# EAGLE schematic BeagleBone Blue (EAGLE 7.3.0)
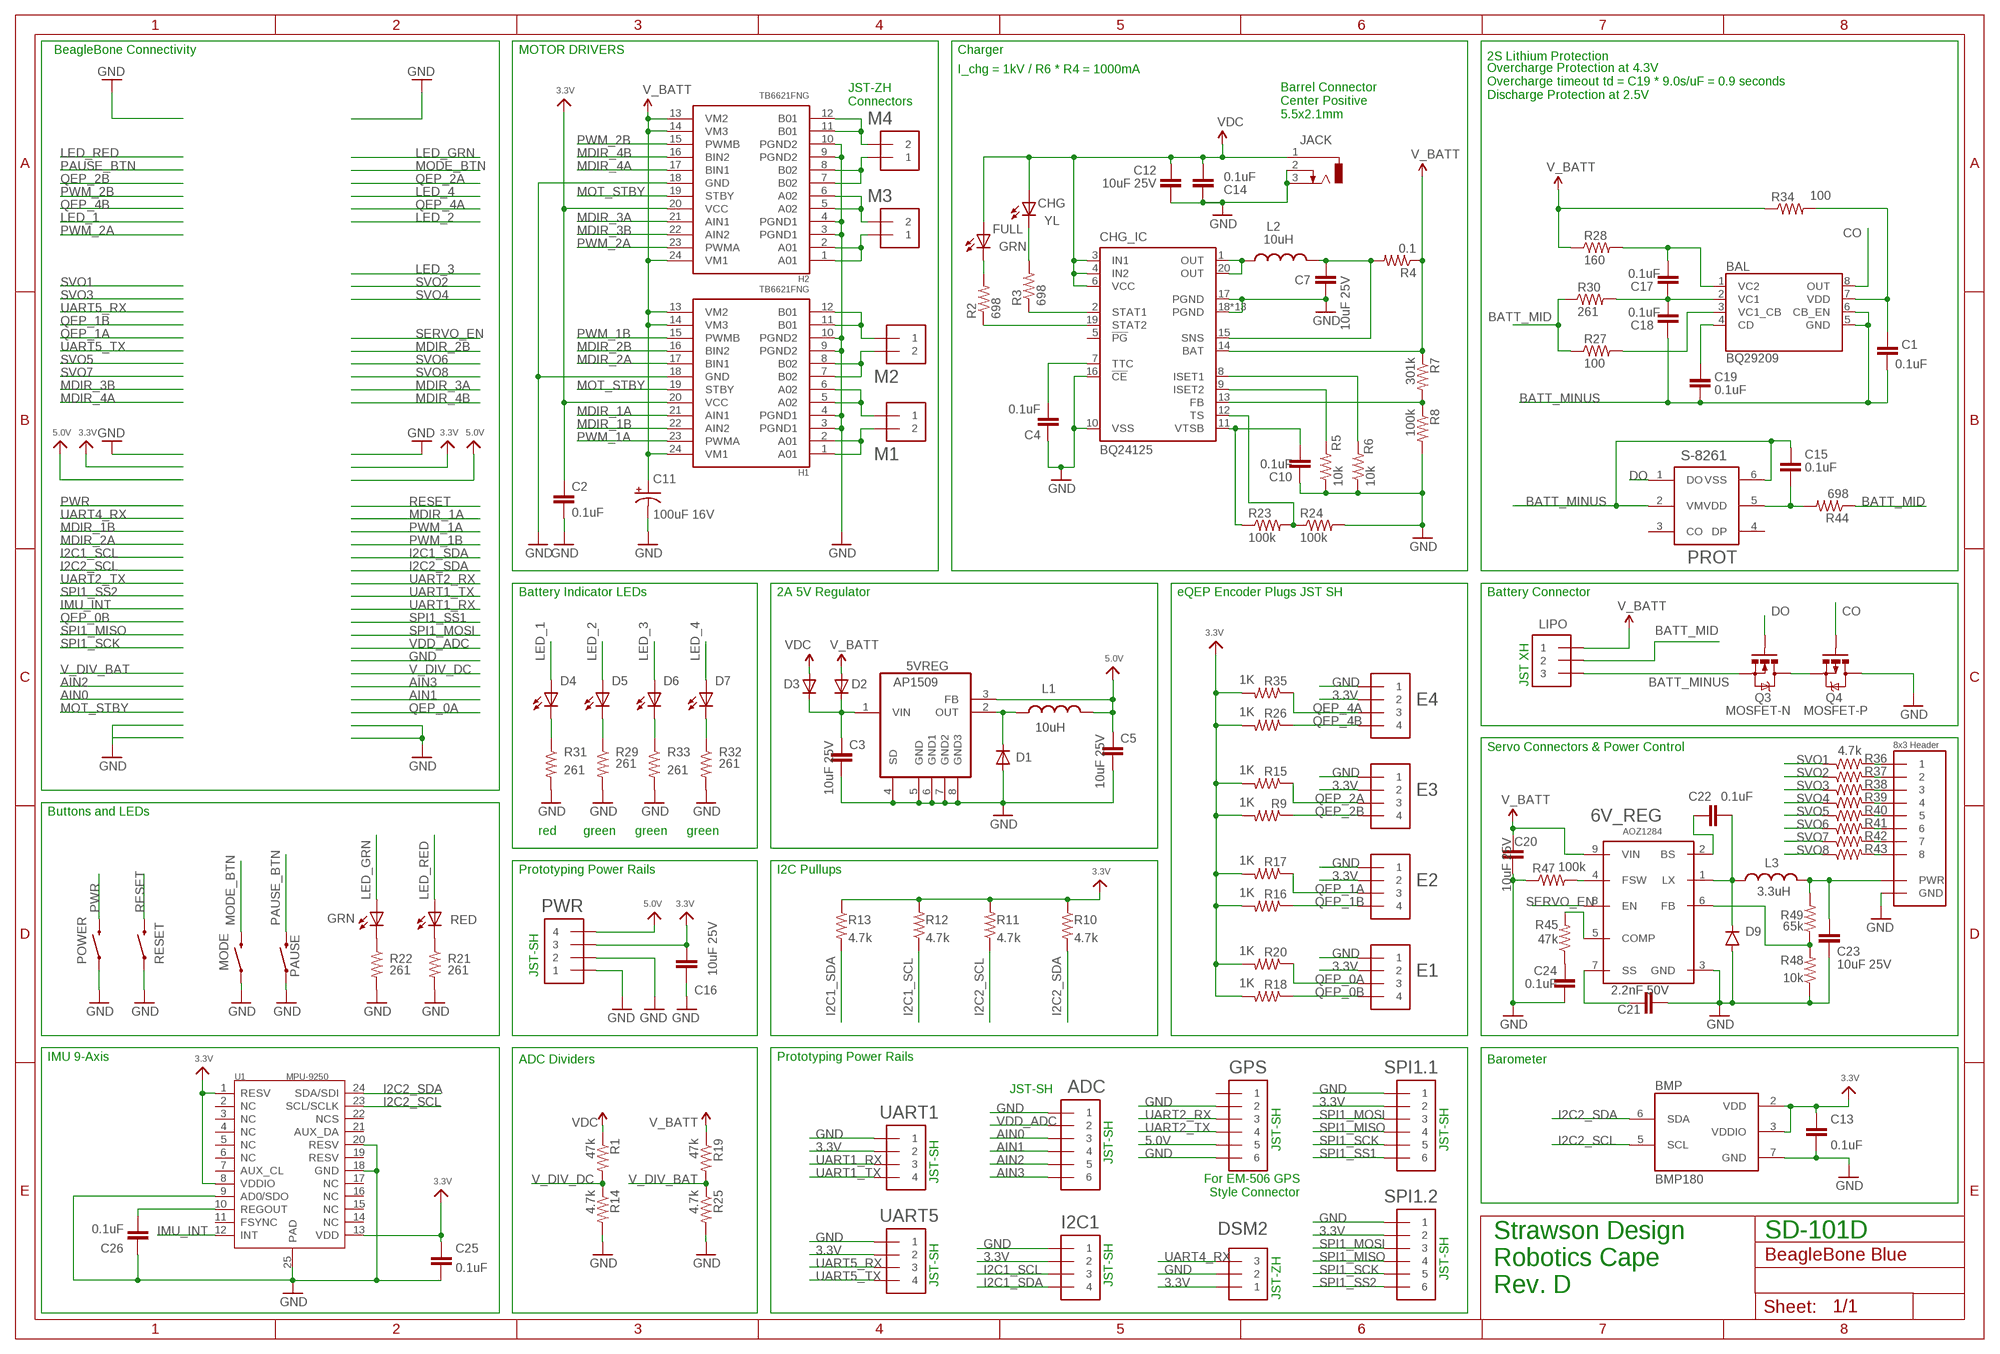
[diagram p0: schematic, sheet 1]

## Parts
5VREG  AP1509SOIC-8-TIGHT  [SO08-TIGHT]
6V_REG  AOZ1284  [SO08-EXPOSED]
ADC  JST_SH_6  [JST_SH_6]
BAL  BQ29209  [8-SON_3X3MM]
BMP  BMP180  [BMP180]
C1  0.1uF  CAP0402-CAP  [0402-CAP]
C2  0.1uF  CAP0402-CAP  [0402-CAP]
C3  10uF 25V  CAP0805  [0805]
C4  0.1uF  CAP0402-CAP  [0402-CAP]
C5  10uF 25V  CAP0805  [0805]
C7  10uF 25V  CAP0805  [0805]
C10  0.1uF  CAP0402-CAP  [0402-CAP]
C11  100uF 16V  CPOL-USD  [PANASONIC_D]
C12  10uF 25V  CAP0805  [0805]
C13  0.1uF  CAP0402-CAP  [0402-CAP]
C14  0.1uF  CAP0402-CAP  [0402-CAP]
C15  0.1uF  CAP0402-CAP  [0402-CAP]
C16  10uF 25V  CAP0805  [0805]
C17  0.1uF  CAP0402-CAP  [0402-CAP]
C18  0.1uF  CAP0402-CAP  [0402-CAP]
C19  0.1uF  CAP0402-CAP  [0402-CAP]
C20  10uF 25V  CAP0805  [0805]
C21  2.2nF 50V  CAP0402-CAP  [0402-CAP]
C22  0.1uF  CAP0402-CAP  [0402-CAP]
C23  10uF 25V  CAP0805  [0805]
C24  0.1uF  CAP0402-CAP  [0402-CAP]
C25  0.1uF  CAP0402-CAP  [0402-CAP]
C26  0.1uF  CAP0402-CAP  [0402-CAP]
CHG  YL  LED0603  [LED-0603]
CHG_IC  BQ24125  [QFN20_3,5X4,5]
D1  DIODESOD-123  [SOD-123]
D2  DIODESOD-123  [SOD-123]
D3  DIODESOD-123  [SOD-123]
D4  RED  LED0603  [LED-0603]
D5  GREEN  LED0603  [LED-0603]
D6  GREEN  LED0603  [LED-0603]
D7  GREEN  LED0603  [LED-0603]
D9  DIODEDO214AA  [DO-214AA]
DSM2  JST_ZH_3  [JST_ZH_3]
E1  JST_SH_4  [JST_SH_4_SMD]
E2  JST_SH_4  [JST_SH_4_SMD]
E3  JST_SH_4  [JST_SH_4_SMD]
E4  JST_SH_4  [JST_SH_4_SMD]
FULL  GRN  LED0603  [LED-0603]
GPS  JST_SH_6  [JST_SH_6]
GRN  GRN  LED0603  [LED-0603]
H1  TB6621FNG  [SSOP24]
H2  TB6621FNG  [SSOP24]
I2C1  JST_SH_4  [JST_SH_4_SMD]
JACK  5.5x2.1mm  DCJ0303  [DCJ0303]
L1  10uH  INDUCTORBOURNS_SRN6045  [SRN6045]
L2  10uH  INDUCTORBOURNS_SRN6045  [SRN6045]
L3  3.3uH  INDUCTOR  [8X8MM_INDUCTOR]
LIPO  JST_XH_3-PIN  [JST_XH_3-PIN]
M1  JST_ZH_2  [JST_ZH_2]
M2  JST_ZH_2  [JST_ZH_2]
M3  JST_ZH_2  [JST_ZH_2]
M4  JST_ZH_2  [JST_ZH_2]
MODE  SWITCH-MOMENTARY-2-SMD-1101NE  [TACTILE-SWITCH-1101NE]
PAUSE  SWITCH-MOMENTARY-2-SMD-1101NE  [TACTILE-SWITCH-1101NE]
POWER  SWITCH-MOMENTARY-2-SMD-1101NE  [TACTILE-SWITCH-1101NE]
PROT  S-8261  [SOT-236]
PWR  JST_SH_4  [JST_SH_4_SMD]
Q3  MOSFET-N  MOSFET-NCHANNEL  [SO08-TIGHT]
Q4  MOSFET-P  MOSFET-PCHANNEL  [SO08-TIGHT]
R1  47k  RESISTOR0402-RES  [0402-RES]
R2  698  RESISTOR0402-RES  [0402-RES]
R3  698  RESISTOR0402-RES  [0402-RES]
R4  0.1  RESISTOR0603  [0603-RES]
R5  10k  RESISTOR0402-RES  [0402-RES]
R6  10k  RESISTOR0402-RES  [0402-RES]
R7  301k  RESISTOR0402-RES  [0402-RES]
R8  100k  RESISTOR0402-RES  [0402-RES]
R9  1K  RESISTOR0402-RES  [0402-RES]
R10  4.7k  RESISTOR0402-RES  [0402-RES]
R11  4.7k  RESISTOR0402-RES  [0402-RES]
R12  4.7k  RESISTOR0402-RES  [0402-RES]
R13  4.7k  RESISTOR0402-RES  [0402-RES]
R14  4.7k  RESISTOR0402-RES  [0402-RES]
R15  1K  RESISTOR0402-RES  [0402-RES]
R16  1K  RESISTOR0402-RES  [0402-RES]
R17  1K  RESISTOR0402-RES  [0402-RES]
R18  1K  RESISTOR0402-RES  [0402-RES]
R19  47k  RESISTOR0402-RES  [0402-RES]
R20  1K  RESISTOR0402-RES  [0402-RES]
R21  261  RESISTOR0402-RES  [0402-RES]
R22  261  RESISTOR0402-RES  [0402-RES]
R23  100k  RESISTOR0402-RES  [0402-RES]
R24  100k  RESISTOR0402-RES  [0402-RES]
R25  4.7k  RESISTOR0402-RES  [0402-RES]
R26  1K  RESISTOR0402-RES  [0402-RES]
R27  100  RESISTOR0402-RES  [0402-RES]
R28  160  RESISTOR0402-RES  [0402-RES]
R29  261  RESISTOR0402-RES  [0402-RES]
R30  261  RESISTOR0402-RES  [0402-RES]
R31  261  RESISTOR0402-RES  [0402-RES]
R32  261  RESISTOR0402-RES  [0402-RES]
R33  261  RESISTOR0402-RES  [0402-RES]
R34  100  RESISTOR0402-RES  [0402-RES]
R35  1K  RESISTOR0402-RES  [0402-RES]
R36  4.7k  RESISTOR0402-RES  [0402-RES]
R37  4.7k  RESISTOR0402-RES  [0402-RES]
R38  4.7k  RESISTOR0402-RES  [0402-RES]
R39  4.7k  RESISTOR0402-RES  [0402-RES]
R40  4.7k  RESISTOR0402-RES  [0402-RES]
R41  4.7k  RESISTOR0402-RES  [0402-RES]
R42  4.7k  RESISTOR0402-RES  [0402-RES]
R43  4.7k  RESISTOR0402-RES  [0402-RES]
R44  698  RESISTOR0402-RES  [0402-RES]
R45  47k  RESISTOR0402-RES  [0402-RES]
R47  100k  RESISTOR0402-RES  [0402-RES]
R48  10k  RESISTOR0402-RES  [0402-RES]
R49  65k  RESISTOR0402-RES  [0402-RES]
RED  RED  LED0603  [LED-0603]
RESET  SWITCH-MOMENTARY-2-SMD-1101NE  [TACTILE-SWITCH-1101NE]
SPI1.1  JST_SH_6  [JST_SH_6]
SPI1.2  JST_SH_6  [JST_SH_6]
U1  MPU-9250  [QFN24G-0.4-3X3MM]
U$1  SERVO_HEADERS_8X  [3X8_0.1"_HEADER]
UART1  JST_SH_4  [JST_SH_4_SMD]
UART5  JST_SH_4  [JST_SH_4_SMD]

## Nets
3.3V: BMP.2(VDD) BMP.3(VDDIO) C2.2 C13.1 C16.1 C25.1 DSM2.P$1 E1.2 E2.2 E3.2 E4.2 H1.20(VCC) H2.20(VCC) I2C1.2 PWR.3 R9.2 R10.1 R11.2 R12.2 R13.1 R15.2 R16.2 R17.2 R18.2 R20.2 R26.2 R35.2 SPI1.1.2 SPI1.2.2 U1.1(RESV) U1.8(VDDIO) U1.13(VDD) UART1.2 UART5.2
5.0V: 5VREG.3(FB) C5.1 GPS.5 L1.2 PWR.4
AIN0: ADC.3
AIN1: ADC.4
AIN2: ADC.5
AIN3: ADC.6
BATT_MID: LIPO.P$2 R27.1 R30.1 R44.1
BATT_MINUS: BAL.5(GND) BAL.6(CB_EN) C1.2 C15.1 C18.1 C19.2 LIPO.P$3 PROT.2(VM) PROT.6(VSS) Q3.1(S) Q3.2(S) Q3.3(S)
CO: BAL.8(OUT) Q4.4(G)
DO: PROT.1(DO) Q3.4(G)
GND: 5VREG.4(SD) 5VREG.5(GND) 5VREG.6(GND1) 5VREG.7(GND2) 5VREG.8(GND3) 6V_REG.3(GND) ADC.1 BMP.7(GND) C2.1 C3.2 C4.1 C5.2 C7.2 C10.1 C11.- C12.2 C13.2 C14.1 C16.2 C20.1 C21.1 C23.1 C24.1 C25.2 C26.1 CHG_IC.10(VSS) CHG_IC.16(!CE) CHG_IC.17(PGND) CHG_IC.18(PGND) CHG_IC.EXP(PGND) CHG_IC.EXP@7(PGND) CHG_IC.EXP@8(PGND) CHG_IC.EXP@9(PGND) CHG_IC.EXP@10(PGND) CHG_IC.EXP@11(PGND) CHG_IC.EXP@12(PGND) CHG_IC.GND@1(PGND) CHG_IC.GND@2(PGND) CHG_IC.GND@3(PGND) CHG_IC.GND@4(PGND) CHG_IC.GND@6(PGND) D1.A D9.A DSM2.P$2 E1.1 E2.1 E3.1 E4.1 GPS.2 GPS.6 H1.3(PGND1) H1.4(PGND1) H1.9(PGND2) H1.10(PGND2) H1.18(GND) H2.3(PGND1) H2.4(PGND1) H2.9(PGND2) H2.10(PGND2) H2.18(GND) I2C1.1 JACK.2 JACK.3 MODE.P$1 PAUSE.P$1 POWER.P$1 PWR.1 PWR.2 Q4.5(D) Q4.6(D) Q4.7(D) Q4.8(D) R5.1 R6.1 R8.2 R14.2 R21.2 R22.2 R24.2 R25.2 R29.2 R31.2 R32.2 R33.2 R47.1 R48.1 RESET.P$1 SPI1.1.1 SPI1.2.1 U1.9(AD0/SDO) U1.18(GND) U1.20(RESV) U1.25(PAD) U$1.P$13(GND) U$1.P$14(GND) U$1.P$15(GND) U$1.P$16(GND) U$1.P$17(GND) U$1.P$18(GND) U$1.P$23(GND) U$1.P$24(GND) UART1.1 UART5.1
I2C1_SCL: I2C1.3 R12.1
I2C1_SDA: I2C1.4 R13.2
I2C2_SCL: BMP.5(SCL) R11.1 U1.23(SCL/SCLK)
I2C2_SDA: BMP.6(SDA) R10.2 U1.24(SDA/SDI)
IMU_INT: U1.12(INT)
L3: D6.C R33.1
L4: D7.C R32.1
LED_1: D4.A
LED_2: D5.A
LED_3: D6.A
LED_4: D7.A
LED_GRN: GRN.A
LED_RED: RED.A
MDIR_1A: H1.21(AIN1)
MDIR_1B: H1.22(AIN2)
MDIR_2A: H1.17(BIN1)
MDIR_2B: H1.16(BIN2)
MDIR_3A: H2.21(AIN1)
MDIR_3B: H2.22(AIN2)
MDIR_4A: H2.17(BIN1)
MDIR_4B: H2.16(BIN2)
MODE_BTN: MODE.P$2
MOT1A: H1.1(A01) H1.2(A01) M1.P$2
MOT1B: H1.5(A02) H1.6(A02) M1.P$1
MOT2A: H1.11(B01) H1.12(B01) M2.P$1
MOT2B: H1.7(B02) H1.8(B02) M2.P$2
MOT3A: H2.1(A01) H2.2(A01) M3.P$1
MOT3B: H2.5(A02) H2.6(A02) M3.P$2
MOT4A: H2.11(B01) H2.12(B01) M4.P$2
MOT4B: H2.7(B02) H2.8(B02) M4.P$1
MOT_STBY: H1.19(STBY) H2.19(STBY)
N$1: R36.2 U$1.P$1
N$3: GRN.C R22.1
N$4: BAL.2(VC1) C17.1 C18.2 R30.2
N$6: R21.1 RED.C
N$8: BAL.1(VC2) C17.2 R28.2
N$9: FULL.C R2.2
N$10: 6V_REG.7(SS) C21.2
N$11: C15.2 PROT.5(VDD) R44.2
N$12: CHG_IC.1(OUT) CHG_IC.20(OUT) L2.1
N$13: C7.1 CHG_IC.15(SNS) L2.2 R4.2
N$16: 5VREG.2(OUT) D1.C L1.1
N$17: CHG.C R3.2
N$18: CHG_IC.2(STAT1) R3.1
N$21: Q3.5(D) Q3.6(D) Q3.7(D) Q3.8(D) Q4.1(S) Q4.2(S) Q4.3(S)
N$23: CHG_IC.19(STAT2) R2.1
N$24: BAL.4(CD) C19.1
N$25: R37.2 U$1.P$2
N$28: C10.2 CHG_IC.11(VTSB) R23.1
N$29: BAL.7(VDD) C1.1 R34.2
N$30: R38.2 U$1.P$3
N$31: CHG_IC.12(TS) R23.2 R24.1
N$35: CHG_IC.9(ISET2) R5.2
N$36: CHG_IC.13(FB) R7.2 R8.1
N$37: CHG_IC.8(ISET1) R6.2
N$38: R39.2 U$1.P$4
N$46: C4.2 CHG_IC.7(TTC)
N$48: D5.C R29.1
N$49: D4.C R31.1
N$50: BAL.3(VC1_CB) R27.2
N$51: R40.2 U$1.P$5
N$52: R41.2 U$1.P$6
N$53: 6V_REG.2(BS) C22.1
N$54: R42.2 U$1.P$19
N$56: R43.2 U$1.P$20
N$60: 6V_REG.1(LX) C22.2 D9.C L3.1
N$61: 6V_REG.4(FSW) R47.2
N$62: C23.2 L3.2 R49.2 U$1.P$7(PWR) U$1.P$8(PWR) U$1.P$9(PWR) U$1.P$10(PWR) U$1.P$11(PWR) U$1.P$12(PWR) U$1.P$21(PWR) U$1.P$22(PWR)
N$63: 6V_REG.5(COMP) R45.2
N$65: 6V_REG.6(FB) R48.2 R49.1
N$66: C24.2 R45.1
N$70: C26.2 U1.10(REGOUT)
N$79: 5VREG.1(VIN) C3.1 D2.C D3.C
PAUSE_BTN: PAUSE.P$2
PWM_1A: H1.23(PWMA)
PWM_1B: H1.15(PWMB)
PWM_2A: H2.23(PWMA)
PWM_2B: H2.15(PWMB)
PWR: POWER.P$2
QEP_0A: E1.3 R20.1
QEP_0B: E1.4 R18.1
QEP_1A: E2.3 R17.1
QEP_1B: E2.4 R16.1
QEP_2A: E3.3 R15.1
QEP_2B: E3.4 R9.1
QEP_4A: E4.3 R35.1
QEP_4B: E4.4 R26.1
RESET: RESET.P$2
SERVO_EN: 6V_REG.8(EN)
SPI1_MISO: SPI1.1.4 SPI1.2.4
SPI1_MOSI: SPI1.1.3 SPI1.2.3
SPI1_SCK: SPI1.1.5 SPI1.2.5
SPI1_SS1: SPI1.1.6
SPI1_SS2: SPI1.2.6
SVO1: R36.1
SVO2: R37.1
SVO3: R38.1
SVO4: R39.1
SVO5: R40.1
SVO6: R41.1
SVO7: R42.1
SVO8: R43.1
UART1_RX: UART1.3
UART1_TX: UART1.4
UART2_RX: GPS.3
UART2_TX: GPS.4
UART4_RX: DSM2.P$3
UART5_RX: UART5.3
UART5_TX: UART5.4
V_BATT: 6V_REG.9(VIN) C11.+ C20.2 CHG_IC.14(BAT) D2.A H1.13(VM2) H1.14(VM3) H1.24(VM1) H2.13(VM2) H2.14(VM3) H2.24(VM1) LIPO.P$1 R4.1 R7.1 R19.1 R28.1 R34.1
V_DIV_BAT: R19.2 R25.1
V_DIV_DC: R1.2 R14.1
VCC: C12.1 C14.2 CHG.A CHG_IC.3(IN1) CHG_IC.4(IN2) CHG_IC.6(VCC) D3.A FULL.A JACK.1 R1.1 ; supply symbol labelled VDC
VDD_ADC: ADC.2
Unconnected: CHG_IC.5(!PG) GPS.1 PROT.3(CO) PROT.4(DP) U1.2(NC) U1.3(NC) U1.4(NC) U1.5(NC) U1.6(NC) U1.7(AUX_CL) U1.11(FSYNC) U1.14(NC) U1.15(NC) U1.16(NC) U1.17(NC) U1.19(RESV) U1.21(AUX_DA) U1.22(NCS)

## Notes on the sheet
- BeagleBone Connectivity | MOTOR DRIVERS | Charger
- 2S Lithium Protection
- I_chg = 1kV / R6 * R4 = 1000mA
- Overcharge Protection at 4.3V
  Overcharge timeout td = C19 * 9.0s/uF = 0.9 seconds
  Discharge Protection at 2.5V
- JST-ZH
  Connectors
- Barrel Connector
  Center Positive
  5.5x2.1mm
- Battery Indicator LEDs | 2A 5V Regulator | eQEP Encoder Plugs JST SH | Battery Connector
- JST XH
- Servo Connectors & Power Control
- Buttons and LEDs
- red | green | green | green
- Prototyping Power Rails | I2C Pullups
- JST-SH
- ADC Dividers | Barometer
- IMU 9-Axis | Prototyping Power Rails
- JST-SH
- JST-SH | JST-SH
- JST-SH
- JST-SH
- For EM-506 GPS
  Style Connector
- SD-101D
- JST-SH
- JST-SH | JST-SH
- Strawson Design
  Robotics Cape
  Rev. D
- JST-ZH

## Library data of the parts
5VREG = Strawson_Eagle_Lib:AP1509: 150KHz, 2A PWM BUCK DC/DC CONVERTER
6V_REG = Strawson_Eagle_Lib:AOZ1284
ADC GPS SPI1.1 SPI1.2 = Strawson_Eagle_Lib:JST_SH_6
BAL = Strawson_Eagle_Lib:BQ29209: BQ29209 2-CELL Balance and Overvoltage Protection
BMP = SparkFun-Sensors:BMP180: BOSCH BMP180 DIGITAL BAROMETRIC PRESSURE SENSOR Web page: http://www.bosch-sensortec.com/en/homepage/products_3/environmental_sensors_1/bmp180_1/bmp180 Datasheet: http://ae-bst.resource.bosch.com/media/products/dokumente/bmp180/BST-BMP180-DS000-09.pdf The BMP180 is the function compatible successor of the BMP085, a new generation of high precision digital pressure sensors for consumer applications. The ultra-low power, low voltage electronics of the BMP180 is optimized for use in mobile phones, PDAs, GPS navigation devices and outdoor equipment. With a low altitude noise of merely 0.25m at fast conversion time, the BMP180 offers superior performance. The I2C interface allows for easy system integration with a microcontroller. The BMP180 is based on piezo-resistive technology for EMC robustness, high accuracy and linearity as well as long term stability. Key features: - Temperature measurement included - I2C interface - Fully calibrated - Pb-free, halogen-free and RoHS compliant, - MSL 1 Basic specs: Pressure range: 300 to 1100hPa (+9000m to -500m relating to sea level) Supply voltage: 1.8 to 3.6V (VDD), 1.62V to 3.6V (VDDIO) Package: LGA package with metal lid Small footprint: 3.6mm x 3.8mm Super-flat: 0.93mm height Low power: 5μA at 1 sample / sec. in standard mode Low noise: 0.06hPa (0.5m) in ultra low power mode, 0.02hPa (0.17m) advanced resolution mode Typical applications: - Enhancement of GPS navigation (dead-reckoning, slope detection, etc.) - In- and out-door navigation - Leisure and sports - Weather forecast - Vertical velocity indication (rise/sink speed)
C1 C2 C4 C10 C13-C15 C17-C19 C21 C22 C24-C26 = Strawson_Eagle_Lib:CAP: Capacitor Standard 0603 ceramic capacitor, and 0.1" leaded capacitor.
C3 C5 C7 C12 C16 C20 C23 = SparkFun-Capacitors:CAP: Capacitor Standard 0603 ceramic capacitor, and 0.1" leaded capacitor.
C11 = adafruit:CPOL-US: POLARIZED CAPACITOR, American symbol
CHG D4-D7 FULL GRN RED = SparkFun-LED:LED: LEDs Standard schematic elements and footprints for 5mm, 3mm, 1206, and 0603 sized LEDs. 5mm - Spark Fun Electronics SKU : COM-00529 (and others)
CHG_IC = Strawson_Eagle_Lib:BQ24125: SINGLE-CHIP SWITCHMODE, LI-ION AND LI-POLYMER CHARGE-MANAGEMENT IC WITH ENHANCED EMI PERFORMANCE(bqSWITCHER) Source: www.ti.com .. TI-bq24125.pdf; MPN: BQ24125RHLR; OC_FARNELL: 1536712; OC_NEWARK: 71M2021
D1-D3 = adafruit:DIODE: Diode
D9 = Strawson_Eagle_Lib:DIODE: Diode
DSM2 = Strawson_Eagle_Lib:JST_ZH_3
E1-E4 I2C1 PWR UART1 UART5 = Strawson_Eagle_Lib:JST_SH_4
H1 H2 = SparkFun:TB6621FNG: Toshiba 1A motor driver
JACK = con-jack:DCJ0303: DC POWER JACK Source: DCJ0303.pdf; OC_FARNELL: unknown; OC_NEWARK: unknown
L1 L2 = SparkFun-Passives:INDUCTOR: Inductors; PROD_ID: NDUC-11627; VALUE: 33uH
L3 = Strawson_Eagle_Lib:INDUCTOR: Inductors
LIPO = Strawson_Eagle_Lib:JST_XH_3-PIN
M1-M4 = Strawson_Eagle_Lib:JST_ZH_2
MODE PAUSE POWER RESET = SparkFun-Electromechanical:SWITCH-MOMENTARY-2: Various NO switches- pushbuttons, reed, etc
PROT = Strawson_Eagle_Lib:S-8261
Q3 = Strawson_Eagle_Lib:MOSFET-NCHANNEL: Common NMOSFET Parts MFG P/N Store ID Prod ID FDD8780 TRANS-09984 SI7820DN TRANS-11055 FDS6630A IC-08089 2N7002PW TRANS-11151 FQP30N06L COM-10213 TRANS-10060 BSS123LT1G TRANS-08345 BSS138 TRANS-00830 BS170 2N7000
Q4 = Strawson_Eagle_Lib:MOSFET-PCHANNEL: Generic PMOSFET IRLML2244 - TRANS-11153 (SOT-23 -20V -4.3A) (1.Gate 2.Source 3.Drain) FQP27P06 - COM-10349 <http://www.sparkfun.com/products/10349> (TO-220 -60V -27A) (1.Gate 2.Source 3.Drain)
R1-R3 R5-R45 R47-R49 = Strawson_Eagle_Lib:RESISTOR: Resistor Basic schematic elements and footprints for 0603, 1206, and PTH resistors.
R4 = SparkFun-Resistors:RESISTOR: Resistor Basic schematic elements and footprints for 0603, 1206, and PTH resistors.
U1 = Strawson_Eagle_Lib:MPU-9250: 314990005; MPN: MPU-9250
U$1 = Strawson_Eagle_Lib:SERVO_HEADERS_8X